# Altium schematic sheet 1_P1.schdoc.schdoc (part 1 of 2)
size 431 x 309 mm; Symbol: Sheet-Symbol_B; Device: Sheet-Symbol_B; @Page Name: P1; @Create Date: 2023-11-21; @Page Count: 1; @Page No: 1; @Project Name: Development Board F-II; @Schematic Name: Schematic1; @Update Date: 2023-11-21; Company: 嘉立创EDA; Page Size: B; Version: V1.0
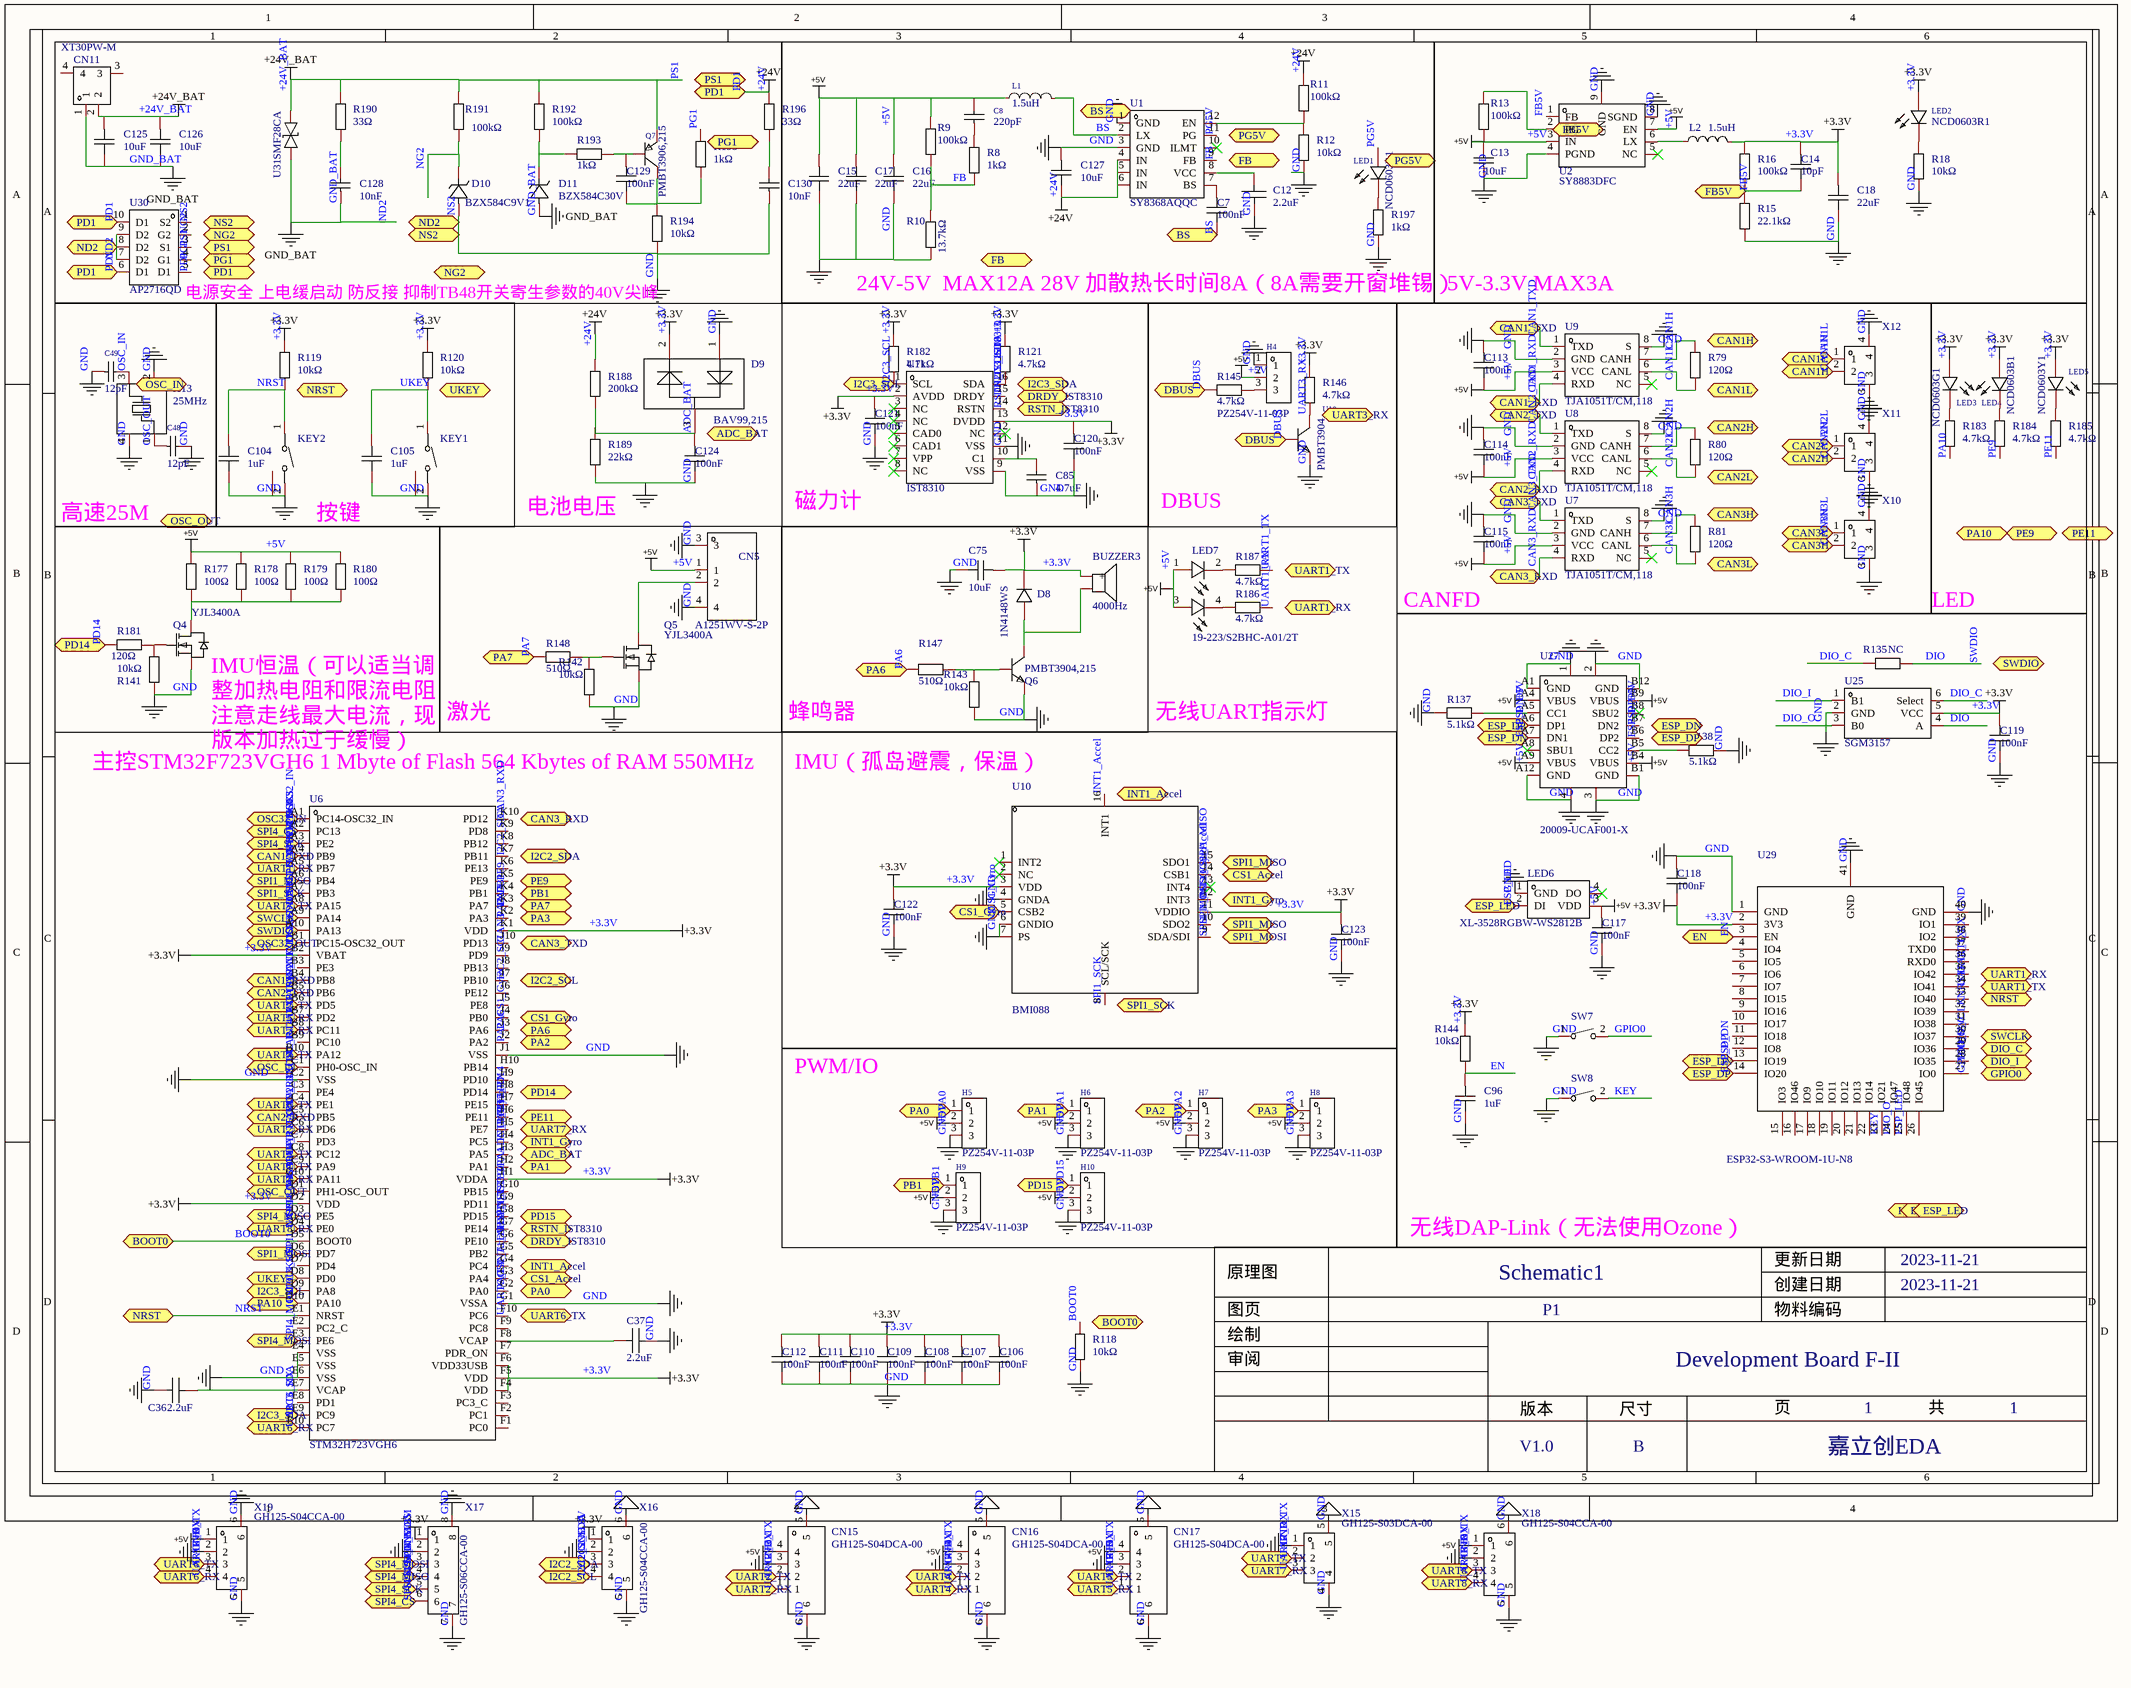
[diagram p0: 1_P1.schdoc.schdoc]

## Parts
BUZZER3  4000Hz  [BUZ-SMD_L4.0-W4.0-P3.50-L]
C7  100nF  [C0402]
C8  220pF  [C0402]
C12  2.2uF  [C0402]
C13  10uF  [C0402]
C14  10pF  [C0402]
C15  22uF  [C0603]
C16  22uF  [C0603]
C17  22uF  [C0603]
C18  22uF  [C0603]
C36  2.2uF  [C0402]
C37  2.2uF  [C0402]
C48  12pF  [C0402]
C49  12pF  [C0402]
C75  10uF  [C0603]
C85  4.7uF  [C0402]
C96  1uF  [C0402]
C104  1uF  [C0402]
C105  1uF  [C0402]
C106  100nF  [C0402]
C107  100nF  [C0402]
C108  100nF  [C0402]
C109  100nF  [C0402]
C110  100nF  [C0402]
C111  100nF  [C0402]
C112  100nF  [C0402]
C113  100nF  [C0402]
C114  100nF  [C0402]
C115  100nF  [C0402]
C117  100nF  [C0402]
C118  100nF  [C0402]
C119  100nF  [C0402]
C120  100nF  [C0402]
C121  100nF  [C0402]
C122  100nF  [C0402]
C123  100nF  [C0402]
C124  100nF  [C0402]
C125  10uF  [C0805]
C126  10uF  [C0805]
C127  10uF  [C0805]
C128  10nF  [C0402]
C129  100nF  [C0402]
C130  10nF  [C0402]
CN5  A1251WV-S-2P  [CONN-SMD_2P-P1.25_A1251WV-S-2P]
CN11  XT30PW-M  [CONN-TH_XT30PW-M]
CN15  GH125-S04DCA-00  [CONN-SMD_4P-P1.27_GH125-S04DCA-00]
CN16  GH125-S04DCA-00  [CONN-SMD_4P-P1.27_GH125-S04DCA-00]
CN17  GH125-S04DCA-00  [CONN-SMD_4P-P1.27_GH125-S04DCA-00]
D8  1N4148WS  [SOD-323_L1.8-W1.3-LS2.5-RD]
D9  BAV99,215  [SOT-23-3_L2.9-W1.6-P1.90-LS2.8-BR]
D10  BZX584C9V1  [ESC_L1.2-W0.8-LS1.6-RD]
D11  BZX584C30V  [SOD-523_L1.2-W0.8-LS1.6-RD]
H4  PZ254V-11-03P  [HDR-TH_3P-P2.54-V-M]
H5  PZ254V-11-03P  [HDR-TH_3P-P2.54-V-M]
H6  PZ254V-11-03P  [HDR-TH_3P-P2.54-V-M]
H7  PZ254V-11-03P  [HDR-TH_3P-P2.54-V-M]
H8  PZ254V-11-03P  [HDR-TH_3P-P2.54-V-M]
H9  PZ254V-11-03P  [HDR-TH_3P-P2.54-V-M]
H10  PZ254V-11-03P  [HDR-TH_3P-P2.54-V-M]
KEY1  1TS003B-2500-3500A-CT  [KEY-SMD_1TS003B-2500-3500A-CT]  (value not drawn)
KEY2  1TS003B-2500-3500A-CT  [KEY-SMD_1TS003B-2500-3500A-CT]  (value not drawn)
L1  1.5uH  [IND-SMD_L7.0-W6.6]
L2  1.5uH  [L0806]
LED1  NCD0603R1  [LED0603-RD_RED]
LED2  NCD0603R1  [LED0603-RD_RED]
LED3  NCD0603G1  [LED0603-RD]
LED4  NCD0603B1  [LED0603-RD]
LED5  NCD0603Y1  [LED0603-RD]
LED6  XL-3528RGBW-WS2812B  [LED-SMD_4P-L3.5-W2.8-BR-1]
LED7  19-223/S2BHC-A01/2T  [LED-ARRAY-SMD_4P-L1.6-W1.5-BR_19-223]
Q4  YJL3400A  [SOT-23-3_L2.9-W1.3-P1.90-LS2.4-BR]
Q5  YJL3400A  [SOT-23-3_L2.9-W1.3-P1.90-LS2.4-BR]
Q6  PMBT3904,215  [SOT-23_L2.9-W1.3-P1.90-LS2.4-BR]
Q7  PMBT3906,215  [SOT-23-3_L2.9-W1.3-P1.90-LS2.4-BR]
R8  1kΩ  [R0402]
R9  100kΩ  [R0402]
R10  13.7kΩ  [R0402]
R11  100kΩ  [R0402]
R12  10kΩ  [R0402]
R13  100kΩ  [R0402]
R15  22.1kΩ  [R0402]
R16  100kΩ  [R0402]
R18  10kΩ  [R0402]
R79  120Ω  [R0402]
R80  120Ω  [R0402]
R81  120Ω  [R0402]
R118  10kΩ  [R0402]
R119  10kΩ  [R0402]
R120  10kΩ  [R0402]
R121  4.7kΩ  [R0402]
R135  value NC  [R0402]  (hidden comment: R0402)
R137  5.1kΩ  [R0402]
R138  5.1kΩ  [R0402]
R141  10kΩ  [R0402]
R142  10kΩ  [R0402]
R143  10kΩ  [R0402]
R144  10kΩ  [R0402]
R145  4.7kΩ  [R0402]
R146  4.7kΩ  [R0402]
R147  510Ω  [R0402]
R148  510Ω  [R0402]
R177  100Ω  [R0603]
R178  100Ω  [R0603]
R179  100Ω  [R0603]
R180  100Ω  [R0603]
R181  120Ω  [R0402]
R182  4.7kΩ  [R0402]
R183  4.7kΩ  [R0402]
R184  4.7kΩ  [R0402]
R185  4.7kΩ  [R0402]
R186  4.7kΩ  [R0402]
R187  4.7kΩ  [R0402]
R188  200kΩ  [R0402]
R189  22kΩ  [R0402]
R190  33Ω  [R0402]
R191  100kΩ  [R0402]
R192  100kΩ  [R0402]
R193  1kΩ  [R0402]
R194  10kΩ  [R0402]
R195  1kΩ  [R0402]
R196  33Ω  [R0402]
R197  1kΩ  [R0402]
SW7  TS-1185-C-A-A-A  [SW-SMD_L4.0-W3.0-LS5.0-EH]  (value not drawn)
SW8  TS-1185-C-A-A-A  [SW-SMD_L4.0-W3.0-LS5.0-EH]  (value not drawn)
U1  SY8368AQQC  [QFN-12_L3.0-W3.0-P0.45-TL-EP]
U2  SY8883DFC  [WDFN-8_L2.0-W2.0-P0.50-BL-EP]
U6  STM32H723VGH6  [TFBGA-100_L8.0-W8.0-R10-C10-P0.80-BL]
U7  TJA1051T/CM,118  [SOIC-8_L5.0-W4.0-P1.27-LS6.1-BL]
U8  TJA1051T/CM,118  [SOIC-8_L5.0-W4.0-P1.27-LS6.1-BL]
U9  TJA1051T/CM,118  [SOIC-8_L5.0-W4.0-P1.27-LS6.1-BL]
U10  BMI088  [LGA-16_L4.5-W3.0-P0.50-BL]
U11  IST8310  [LGA-16_L3.0-W3.0-P0.5-BL]
U19  PMBT3904  [SOT-23-3_L2.9-W1.3-P1.90-LS2.4-BR]
U25  SGM3157  [SC-70-6_L2.2-W1.3-P0.65-LS2.1-BL]
U27  20009-UCAF001-X  [TYPE-C-SMD_20009-UCAF001-X]
U29  ESP32-S3-WROOM-1U-N8  [WIRELM-SMD_ESP32-S3-WROOM-1U]
U30  AP2716QD  [PDFN-8_L3.2-W3.1-P0.65-LS3.4-BL-EP2]
U31  SMF28CA  [SOD-123FL_L2.8-W1.8-LS3.7-BI]
X10  GH125-S02DCA-00  [CONN-SMD_2P-P1.25_JUSHUO_GH125-S02DCA-00]  (value not drawn)
X11  GH125-S02DCA-00  [CONN-SMD_2P-P1.25_JUSHUO_GH125-S02DCA-00]  (value not drawn)
X12  GH125-S02DCA-00  [CONN-SMD_2P-P1.25_JUSHUO_GH125-S02DCA-00]  (value not drawn)
X13  25MHz  [OSC-SMD_4P-L3.2-W2.5-BL]
X15  GH125-S03DCA-00  [CONN-SMD_3P-P1.25_JUSHUO_GH125-S03DCA-00]
X16  GH125-S04CCA-00  [CONN-SMD_4P-P1.25_JS_GH125-S04CCA-00]
X17  GH125-S06CCA-00  [CONN-SMD_6P-P1.25_JS_GH125-S06CCA-00]
X18  GH125-S04CCA-00  [CONN-SMD_4P-P1.25_JS_GH125-S04CCA-00]
X19  GH125-S04CCA-00  [CONN-SMD_4P-P1.25_JS_GH125-S04CCA-00]

## Blocks framed on the sheet
电源安全 上电缓启动 防反接 抑制TB48开关寄生参数的40V尖峰: C125 C126 C128-C130 CN11 D10 D11 Q7 R190-R196 U30 U31
24V-5V  MAX12A 28V 加散热长时间8A（8A需要开窗堆锡）: C7 C8 C12 C15-C17 C127 L1 LED1 R8-R12 R197 U1
5V-3.3V MAX3A: C13 C14 C18 L2 LED2 R13 R15 R16 R18 U2
高速25M: C48 C49 X13
按键: C104 C105 KEY1 KEY2 R119 R120
DBUS: H4 R145 R146 U19
LED: LED3-LED5 R183-R185
PWM/IO: H5-H10

## Ports
ADC_BAT (bidir), BOOT0 (bidir), BS (bidir), CAN1_RXD (bidir), CAN1_TXD (bidir), CAN1H (bidir), CAN1L (bidir), CAN2_RXD (bidir), CAN2_TXD (bidir), CAN2H (bidir), CAN2L (bidir), CAN3_RXD (bidir), CAN3_TXD (bidir), CAN3H (bidir), CAN3L (bidir), CS1_Accel (bidir), CS1_Gyro (bidir), DBUS (bidir), DIO_C (bidir), DIO_I (bidir), DIO_O (bidir), DRDY_IST8310 (bidir), EN (bidir), ESP_DN (bidir), ESP_DP (bidir), ESP_LED (bidir), FB5V (bidir), FB (bidir), GPIO0 (bidir), I2C2_SCL (bidir), I2C2_SDA (bidir), I2C3_SCL (bidir), I2C3_SDA (bidir), INT1_Accel (bidir), INT1_Gyro (bidir), KEY (bidir), ND2 (bidir), NG2 (bidir), NRST (bidir), NS2 (bidir), OSC32_IN (bidir), OSC32_OUT (bidir), OSC_IN (bidir), OSC_OUT (bidir), PA0 (bidir), PA1 (bidir), PA2 (bidir), PA3 (bidir), PA6 (bidir), PA7 (bidir), PA10 (bidir), PB1 (bidir), PD1 (bidir), PD14 (bidir), PD15 (bidir), PE9 (bidir), PE11 (bidir), PG1 (bidir), PG5V (bidir), PS1 (bidir), RSTN_IST8310 (bidir), SPI1_MISO (bidir), SPI1_MOSI (bidir), SPI1_SCK (bidir), SPI4_CS (bidir), SPI4_MISO (bidir), SPI4_MOSI (bidir), SPI4_SCK (bidir), SWCLK (bidir), SWDIO (bidir), UART1_RX (bidir), UART1_TX (bidir), UART2_RX (bidir), UART2_TX (bidir), UART3_RX (bidir), UART4_RX (bidir), UART4_TX (bidir), UART5_RX (bidir), UART5_TX (bidir), UART6_RX (bidir), UART6_TX (bidir), UART7_RX (bidir), UART7_TX (bidir), UART8_RX (bidir), UART8_TX (bidir), UKEY (bidir)

## Nets
+3.3V: BUZZER3.1(+) C14.2 C18.2 C75.2 C106.2 C107.2 C108.2 C109.2 C110.2 C111.2 C112.2 C118.1 C119.2 C120.2 C121.2 C122.2 C123.2 D8.1(K) D9.2 L2.2 LED2.2(A) LED3.2(A) LED4.2(+) LED5.2(A) R16.1 R119.2 R120.2 R121.2 R144.2 R146.2 R182.2 U6.B2(VBAT) U6.D2(VDD) U6.F4(VDD) U6.F5(VDD) U6.F6(VDD33USB) U6.H1(VDDA) U6.K1(VDD) U10.3(VDD) U10.11(VDDIO) U11.2(AVDD) U11.13(DVDD) U25.5(VCC) U29.2(3V3) X16.1 X17.1
+5V: C8.2 C13.2 C15.2 C16.2 C17.2 C113.1 C114.1 C115.1 C117.2 CN5.1 CN15.4 CN16.4 CN17.4 H4.2 H5.2 H6.2 H7.2 H8.2 H9.2 H10.2 L1.1 LED6.3(VDD) LED7.1(+) LED7.3(+) R9.2 R13.1 R177.2 R178.2 R179.2 R180.2 U2.3(IN) U2.7(EN) U7.3(VCC) U8.3(VCC) U9.3(VCC) U27.A4(VBUS) U27.A9(VBUS) U27.B4(VBUS) U27.B9(VBUS) X18.1 X19.1
+24V: C127.1 R11.2 R188.2 R196.2 U1.4(IN) U1.5(IN) U1.6(IN) U30.5(D1) U30.6(D1) U30.10(D1) ; port PD1  [also labelled PD1]
+24V_BAT: C125.2 C126.2 CN11.2 Q7.2(E) R190.2 R191.2 R192.2 U30.3(S1) U31.2  [also labelled PS1]
GND: C12.1 C13.1 C15.1 C16.1 C17.1 C18.1 C36.1 C37.2 C48.2 C49.1 C75.1 C85.1 C96.1 C104.1 C105.1 C106.1 C107.1 C108.1 C109.1 C110.1 C111.1 C112.1 C113.2 C114.2 C115.2 C117.1 C118.2 C119.1 C120.1 C121.1 C122.1 C123.1 C124.1 C127.2 C130.1 CN5.3 CN5.4 CN15.3 CN15.5 CN15.6 CN16.3 CN16.5 CN16.6 CN17.3 CN17.5 CN17.6 D9.1 D10.2(A) H4.1 H5.3 H6.3 H7.3 H8.3 H9.3 H10.3 KEY1.0 KEY1.2 KEY2.0 KEY2.2 LED6.1(GND) Q4.2(S) Q5.2(S) Q6.2 R10.1 R12.1 R15.1 R18.1 R118.1 R137.1 R138.2 R141.1 R142.1 R143.1 R189.1 R194.1 R197.1 SW7.1 SW8.1 U1.1(GND) U1.3(GND) U2.4(PGND) U2.8(SGND) U2.9(GND) U6.C2(VSS) U6.E4(VSS) U6.E5(VSS) U6.E6(VSS) U6.G1(VSSA) U6.J1(VSS) U7.2(GND) U7.8(S) U8.2(GND) U8.8(S) U9.2(GND) U9.8(S) U10.4(GNDA) U10.6(GNDIO) U10.7(PS) U11.9(VSS) U11.11(VSS) U19.2(E) U25.2(GND) U27.1 U27.2 U27.3 U27.4 U27.A1(GND) U27.A12(GND) U27.B1(GND) U27.B12(GND) U29.1(GND) U29.40(GND) U29.41(GND) U30.1(S2) X10.3 X10.4 X11.3 X11.4 X12.3 X12.4 X13.2(GND) X13.4(GND) X15.1 X15.4 X15.5 X16.2 X16.5 X16.6 X17.2 X17.7 X17.8 X18.2 X18.5 X18.6 X19.2 X19.5 X19.6  [also labelled NS2]
GND_BAT: C125.1 C126.1 C128.1 CN11.1 D11.2(A) U30.7(D2) U30.8(D2) U30.9(D2) U31.1  [also labelled ND2]
ADC_BAT: C124.2 D9.3 R188.1 R189.2 U6.H3(PA5)
BOOT0: R118.2 U6.D5(BOOT0) ; port BOOT0
BS: C7.1 L1.2 U1.2(LX)
CAN1_RXD: U6.B4(PB8) U9.4(RXD)
CAN1_TXD: U6.A4(PB9) U9.1(TXD)
CAN1H: R79.2 U9.7(CANH) X12.2
CAN1L: R79.1 U9.6(CANL) X12.1
CAN2_RXD: U6.C5(PB5) U8.4(RXD)
CAN2_TXD: U6.B5(PB6) U8.1(TXD)
CAN2H: R80.2 U8.7(CANH) X11.2
CAN2L: R80.1 U8.6(CANL) X11.1
CAN3_RXD: U6.K10(PD12) U7.4(RXD)
CAN3_TXD: U6.J10(PD13) U7.1(TXD)
CAN3H: R81.2 U7.7(CANH) X10.2
CAN3L: R81.1 U7.6(CANL) X10.1
CS1_Accel: U6.G3(PA4) U10.14(CSB1)
CS1_Gyro: U6.J4(PB0) U10.5(CSB2)
DBUS: R145.1 U19.1(B)
DIO: R135.2 U6.A10(PA13) U25.4(A)  [also labelled SWDIO]
DIO_C: R135.1 U25.6(Select) U29.29(IO36)
DIO_I: U25.1(B1) U29.28(IO35)
DIO_O: U25.3(B0) U29.24(IO47)
DRDY_IST8310: U6.G6(PE10) U11.15(DRDY)
EN: C96.2 R144.1 U29.3(EN)
ESP_DN: U27.A7(DN1) U27.B7(DN2) U29.13(IO19)
ESP_DP: U27.A6(DP1) U27.B6(DP2) U29.14(IO20)
ESP_LED: LED6.2(DI) U29.25(IO48)
FB: R8.1 R9.1 R10.2 U1.9(FB)
FB5V: C14.1 R15.2 R16.2 U2.1(FB) ; port FB5V
GPIO0: SW7.2 U29.27(IO0)
I2C2_SCL: U6.J7(PB10) X16.4
I2C2_SDA: U6.K7(PB11) X16.3
I2C3_SCL: R182.1 U6.D9(PA8) U11.1(SCL)
I2C3_SDA: R121.1 U6.E9(PC9) U11.16(SDA)
INT1_Accel: U6.G4(PC4) U10.16(INT1)
INT1_Gyro: U6.H4(PC5) U10.12(INT3)
KEY: SW8.2 U29.23(IO21)
NG2: D10.1(K) R191.1 U30.2(G2)
NRST: C104.2 KEY2.1 R119.1 U6.E1(NRST) U29.33(IO40) ; port NRST
OSC32_IN: U6.A1(PC14-OSC32_IN)
OSC32_OUT: U6.B1(PC15-OSC32_OUT)
OSC_IN: C49.2 U6.C1(PH0-OSC_IN) X13.3(OSC2)
OSC_OUT: C48.1 U6.D1(PH1-OSC_OUT) X13.1(OSC1)
PA0: H5.1 U6.G2(PA0)
PA1: H6.1 U6.H2(PA1)
PA2: H7.1 U6.J2(PA2)
PA3: H8.1 U6.K2(PA3)
PA6: R147.1 U6.J3(PA6)
PA7: R148.1 U6.K3(PA7)
PA10: R183.1 U6.D10(PA10)
PB1: H9.1 U6.K4(PB1)
PD14: R181.2 U6.H8(PD14)
PD15: H10.1 U6.G8(PD15)
PE9: R184.1 U6.K5(PE9)
PE11: R185.1 U6.H6(PE11)
PG1: R195.2 U30.4(G1)
PG5V: LED1.2(A) U1.11(PG)
RSTN_IST8310: U6.G7(PE14) U11.14(RSTN)
SPI1_MISO: U6.A6(PB4) U10.10(SDO2) U10.15(SDO1)
SPI1_MOSI: U6.D6(PD7) U10.9(SDA/SDI)
SPI1_SCK: U6.A7(PB3) U10.8(SCL/SCK)
SPI4_CS: U6.A2(PC13) X17.6
SPI4_MISO: U6.D3(PE5) X17.4
SPI4_MOSI: U6.E3(PE6) X17.3
SPI4_SCK: U6.A3(PE2) X17.5
SWCLK: U6.A9(PA14) U29.30(IO37)
UART1_RX: R186.2 U6.A5(PB7) U29.35(IO42)
UART1_TX: R187.2 U6.C9(PA9) U29.34(IO41)
UART2_RX: CN15.1 U6.C6(PD6)
UART2_TX: CN15.2 U6.B6(PD5)
UART3_RX: R146.1 U6.B8(PC11) U19.3(C)
UART4_RX: CN16.1 U6.C10(PA11)
UART4_TX: CN16.2 U6.B10(PA12)
UART5_RX: CN17.1 U6.B7(PD2)
UART5_TX: CN17.2 U6.C8(PC12)
UART6_RX: U6.E10(PC7) X19.4
UART6_TX: U6.F10(PC6) X19.3
UART7_RX: U6.H5(PE7) X15.3
UART7_TX: U6.A8(PA15) X15.2
UART8_RX: U6.D4(PE0) X18.4
UART8_TX: U6.C4(PE1) X18.3
UKEY: C105.2 KEY1.1 R120.1 U6.D8(PD0)
NetBUZZER3_2: BUZZER3.2 D8.2(A) Q6.3
NetC7_2: C7.2 U1.7(BS)
NetC8_1: C8.1 R8.2
NetC12_2: C12.2 U1.8(VCC)
NetC36_2: C36.2 U6.E7(VCAP)
NetC37_1: C37.1 U6.F8(VCAP)
NetC85_2: C85.2 U11.10(C1)
NetC128_2: C128.2 R190.1
NetC129_1: C129.1 Q7.3(C) R194.2 R195.1
NetC129_2: C129.2 Q7.1(B) R193.2
NetC130_2: C130.2 R196.1
NetCN5_2: CN5.2 Q5.3(D)
NetD11_1: D11.1(K) R192.1 R193.1
NetH4_3: H4.3 R145.2
NetL2_1: L2.1 U2.6(LX)
NetLED1_1: LED1.1(K) R197.2
NetLED2_1: LED2.1(K) R18.2
NetLED3_1: LED3.1(K) R183.2
NetLED4_1: LED4.1(-) R184.2
NetLED5_1: LED5.1(K) R185.2
NetLED7_2: LED7.2(-) R187.1
NetLED7_4: LED7.4(-) R186.1
NetQ4_1: Q4.1(G) R141.2 R181.1
NetQ4_3: Q4.3(D) R177.1 R178.1 R179.1 R180.1
NetQ5_1: Q5.1(G) R142.2 R148.2
NetQ6_1: Q6.1 R143.2 R147.2
NetR11_1: R11.1 R12.2 U1.12(EN)
NetR13_2: R13.2 U2.2(PG)
NetR137_2: R137.2 U27.A5(CC1)
NetR138_1: R138.1 U27.B5(CC2)

Not connected (* = marked no-connect by the designer): CN11 3 4; LED6 4(DO)*; U1 10(ILMT)*; U2 5(NC)*; U6 B3(PE3) B9(PC10) C3(PE4) C7(PD3) D7(PD4) E2(PC2_C) E8(PD1) F1(PC0) F2(PC1) F3(PC3_C) F7(PDR_ON) F9(PC8) G5(PB2) G9(PD11) G10(PB15) H7(PE15) H9(PD10) H10(PB14) J5(PE8) J6(PE12) J8(PB13) J9(PD9) K6(PE13) K8(PB12) K9(PD8); U7 5(NC)*; U8 5(NC)*; U9 5(NC)*; U10 1(INT2)* 2(NC)* 13(INT4)*; U11 3(NC)* 4(NC)* 5(CAD0)* 6(CAD1)* 7(VPP)* 8(NC)* 12(NC)*; U27 A8(SBU1)* B8(SBU2)*; U29 4(IO4) 5(IO5) 6(IO6) 7(IO7) 8(IO15) 9(IO16) 10(IO17) 11(IO18) 12(IO8) 15(IO3) 16(IO46) 17(IO9) 18(IO10) 19(IO11) 20(IO12) 21(IO13) 22(IO14) 26(IO45) 31(IO38) 32(IO39) 36(RXD0) 37(TXD0) 38(IO2) 39(IO1)

## Notes on the sheet
- (near R189) 电池电压
- 磁力计
- (near C115) CANFD
- (near Q4) IMU恒温（可以适当调
  整加热电阻和限流电阻
  注意走线最大电流，现
  版本加热过于缓慢）
- 激光
- 蜂鸣器
- 无线UART指示灯
- 主控STM32F723VGH6 1 Mbyte of Flash 564 Kbytes of RAM 550MHz
- IMU（孤岛避震，保温）
- 无线DAP-Link（无法使用Ozone）
- 1
- 2
- 3
- 4
- 5
- 6
- A
- B
- C
- D
- 原理图
- Schematic1
- 创建日期
- 更新日期
- 2023-11-21
- 审阅
- 绘制
- 图页
- P1
- 物料编码
- Development Board F-II
- 版本
- 尺寸
- 页
- 共
- V1.0
- 嘉立创EDA